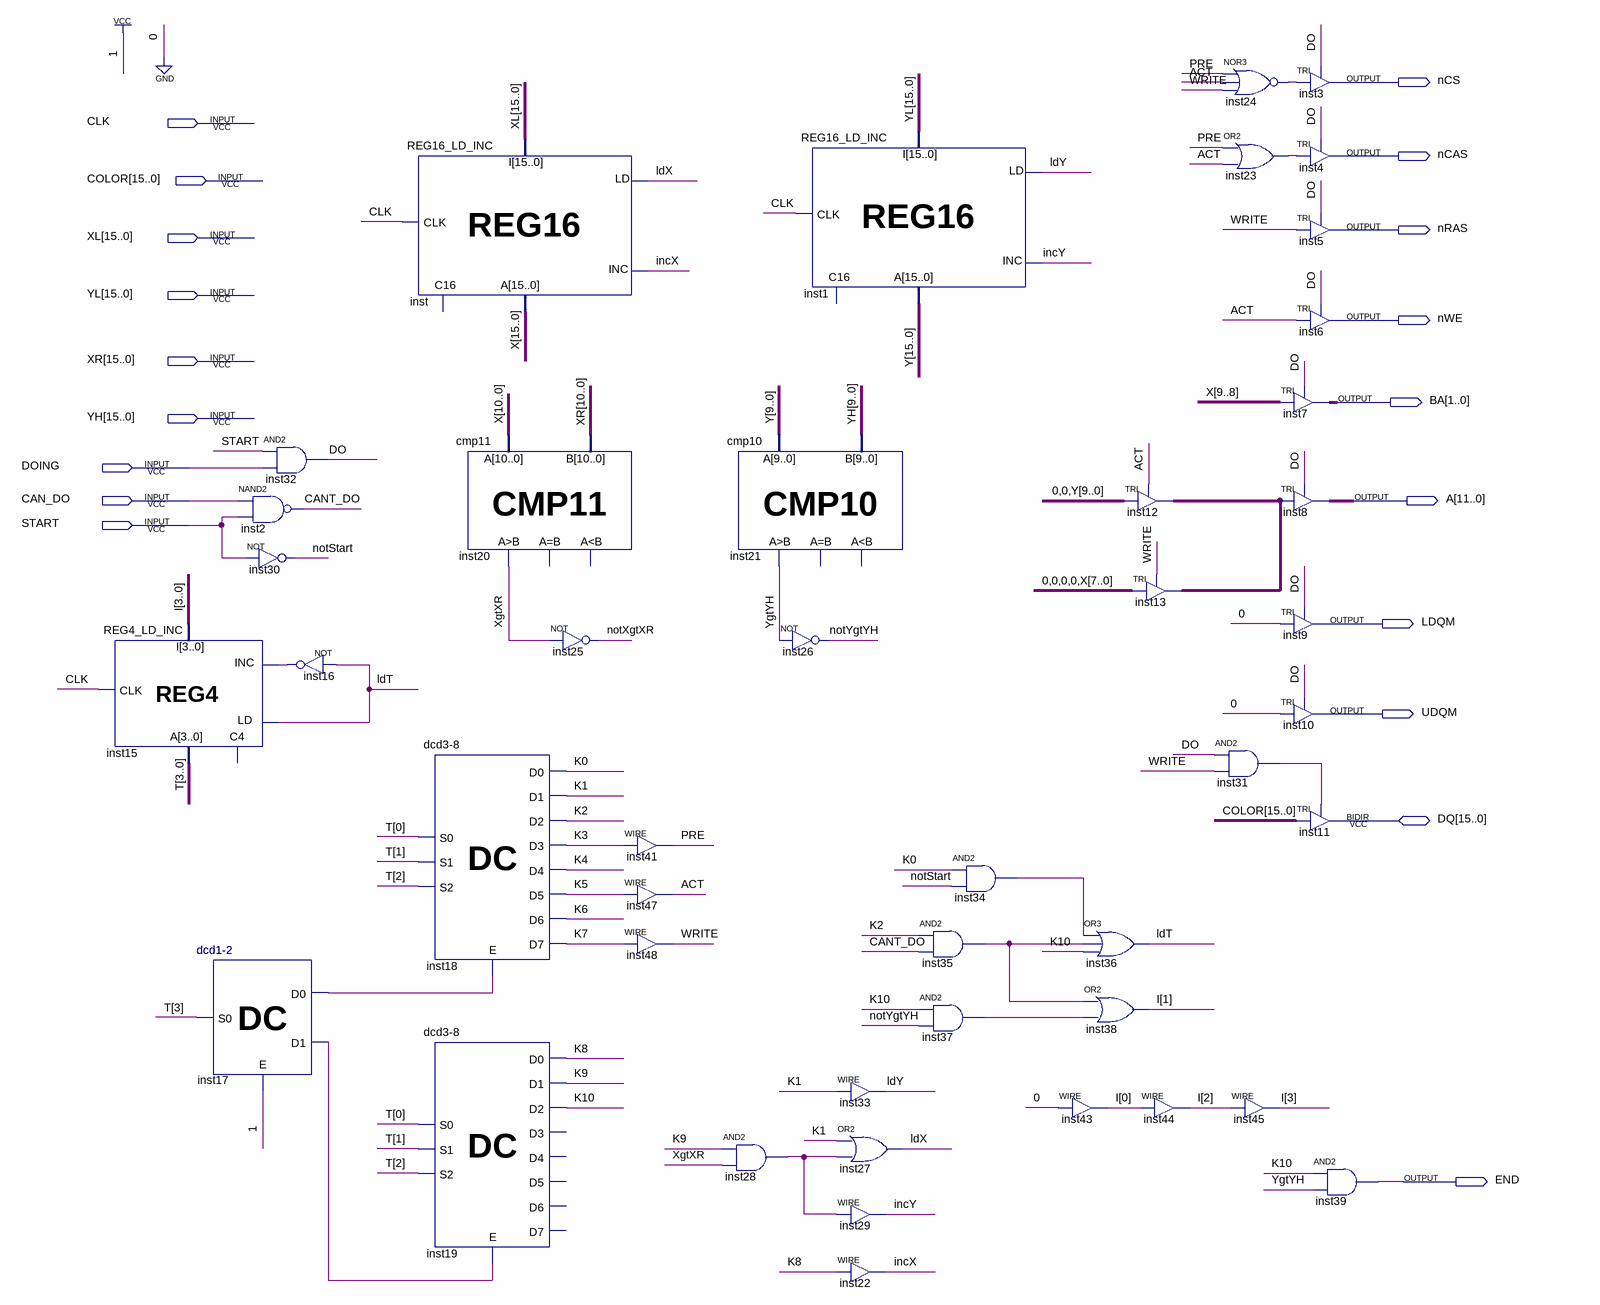
[diagram p0: schematic sheet]
// Quartus schematic gpu_write_rectangle.bdf as structural Verilog: 45 symbols, 19 pins
module gpu_write_rectangle (
  input  CLK,
  input  [15:0] COLOR,
  input  [15:0] XL,
  input  [15:0] YL,
  input  [15:0] XR,
  input  [15:0] YH,
  input  DOING,
  input  CAN_DO,
  input  START,
  inout  [15:0] DQ,
  output nCS,
  output nCAS,
  output nRAS,
  output nWE,
  output [1:0] BA,
  output [11:0] A,
  output LDQM,
  output UDQM,
  output END
);

  wire ACT, CANT_DO, DO, incX, incY, inst16_out, inst17_d0, inst17_d1, inst23_out, inst24_out, inst28_out,
       inst31_out, inst34_out, inst35_out, inst37_out, K0, K1, K2, K3, K4, K5, K6, K7, K8, K9, K10, ldT, ldX,
       ldY, notStart, notXgtXR, notYgtYH, PRE, WRITE, XgtXR, YgtYH;
  wire [3:0] I, T;
  wire [11:0] inst12_out;
  wire [15:0] X, Y;

  REG4_LD_INC inst15 (.LD(ldT), .INC(inst16_out), .CLK(CLK), .I(I), .A(T));  // open: C4
  \dcd1-2  inst17 (.E(1'b1), .S0(T[3]), .D0(inst17_d0), .D1(inst17_d1));
  and inst32 (DO, START, DOING);
  nand inst2 (CANT_DO, CAN_DO, START);
  not inst30 (notStart, START);
  not inst16 (inst16_out, ldT);
  REG16_LD_INC inst (.I(XL), .CLK(CLK), .LD(ldX), .INC(incX), .A(X));  // open: C16
  cmp11 inst20 (.A(X[10:0]), .B(XR[10:0]), .Gt(XgtXR));  // open: Ls, Eq
  \dcd3-8  inst18 (
    .E(inst17_d0), .S0(T[0]), .S1(T[1]), .S2(T[2]), .D0(K0), .D1(K1), .D2(K2), .D3(K3), .D4(K4), .D5(K5),
    .D6(K6), .D7(K7));
  \dcd3-8  inst19 (
    .E(inst17_d1), .S0(T[0]), .S1(T[1]), .S2(T[2]), .D0(K8), .D1(K9), .D2(K10));  // open: D3, D4, D5, D6, D7
  not inst25 (notXgtXR, XgtXR);
  assign PRE = K3;  // WIRE inst41
  assign ACT = K5;  // WIRE inst47
  assign WRITE = K7;  // WIRE inst48
  cmp10 inst21 (.A(Y[9:0]), .B(YH[9:0]), .Gt(YgtYH));  // open: Ls, Eq
  and inst28 (inst28_out, K9, XgtXR);
  not inst26 (notYgtYH, YgtYH);
  REG16_LD_INC inst1 (.I(YL), .CLK(CLK), .LD(ldY), .INC(incY), .A(Y));  // open: C16
  assign ldY = K1;  // WIRE inst33
  or inst27 (ldX, K1, inst28_out);
  assign incY = inst28_out;  // WIRE inst29
  assign incX = K8;  // WIRE inst22
  and inst35 (inst35_out, K2, CANT_DO);
  and inst37 (inst37_out, K10, notYgtYH);
  and inst34 (inst34_out, K0, notStart);
  or inst36 (ldT, inst34_out, inst35_out, K10);
  or inst38 (I[1], inst35_out, inst37_out);
  assign I[0] = 1'b0;  // WIRE inst43
  TRI inst12[11:0] (.IN({2'b00, Y[9:0]}), .OE(ACT), .OUT(inst12_out));
  TRI inst13[11:0] (.IN({4'b0000, X[7:0]}), .OE(WRITE), .OUT(inst12_out));
  assign I[2] = I[0];  // WIRE inst44
  nor inst24 (inst24_out, PRE, ACT, WRITE);
  or inst23 (inst23_out, PRE, ACT);
  and inst31 (inst31_out, DO, WRITE);
  assign I[3] = I[2];  // WIRE inst45
  TRI inst3 (.IN(inst24_out), .OE(DO), .OUT(nCS));
  TRI inst4 (.IN(inst23_out), .OE(DO), .OUT(nCAS));
  TRI inst5 (.IN(WRITE), .OE(DO), .OUT(nRAS));
  TRI inst6 (.IN(ACT), .OE(DO), .OUT(nWE));
  TRI inst7[1:0] (.IN(X[9:8]), .OE(DO), .OUT(BA));
  TRI inst8[11:0] (.IN(inst12_out), .OE(DO), .OUT(A));
  TRI inst9 (.IN(1'b0), .OE(DO), .OUT(LDQM));
  TRI inst10 (.IN(1'b0), .OE(DO), .OUT(UDQM));
  TRI inst11[15:0] (.IN(COLOR), .OE(inst31_out), .OUT(DQ));
  and inst39 (END, K10, YgtYH);
endmodule
